# EasyEDA Pro project Ada - V2 as built.eprj

# Schematic Main Board

## Sheets
1 Daughter Cards: Board Name: Board1; Create Date: 2024-08-08; Page Name: Daughter Cards; Project Name: Ada; Schematic Name: Main Board; Update Date: 2024-10-03
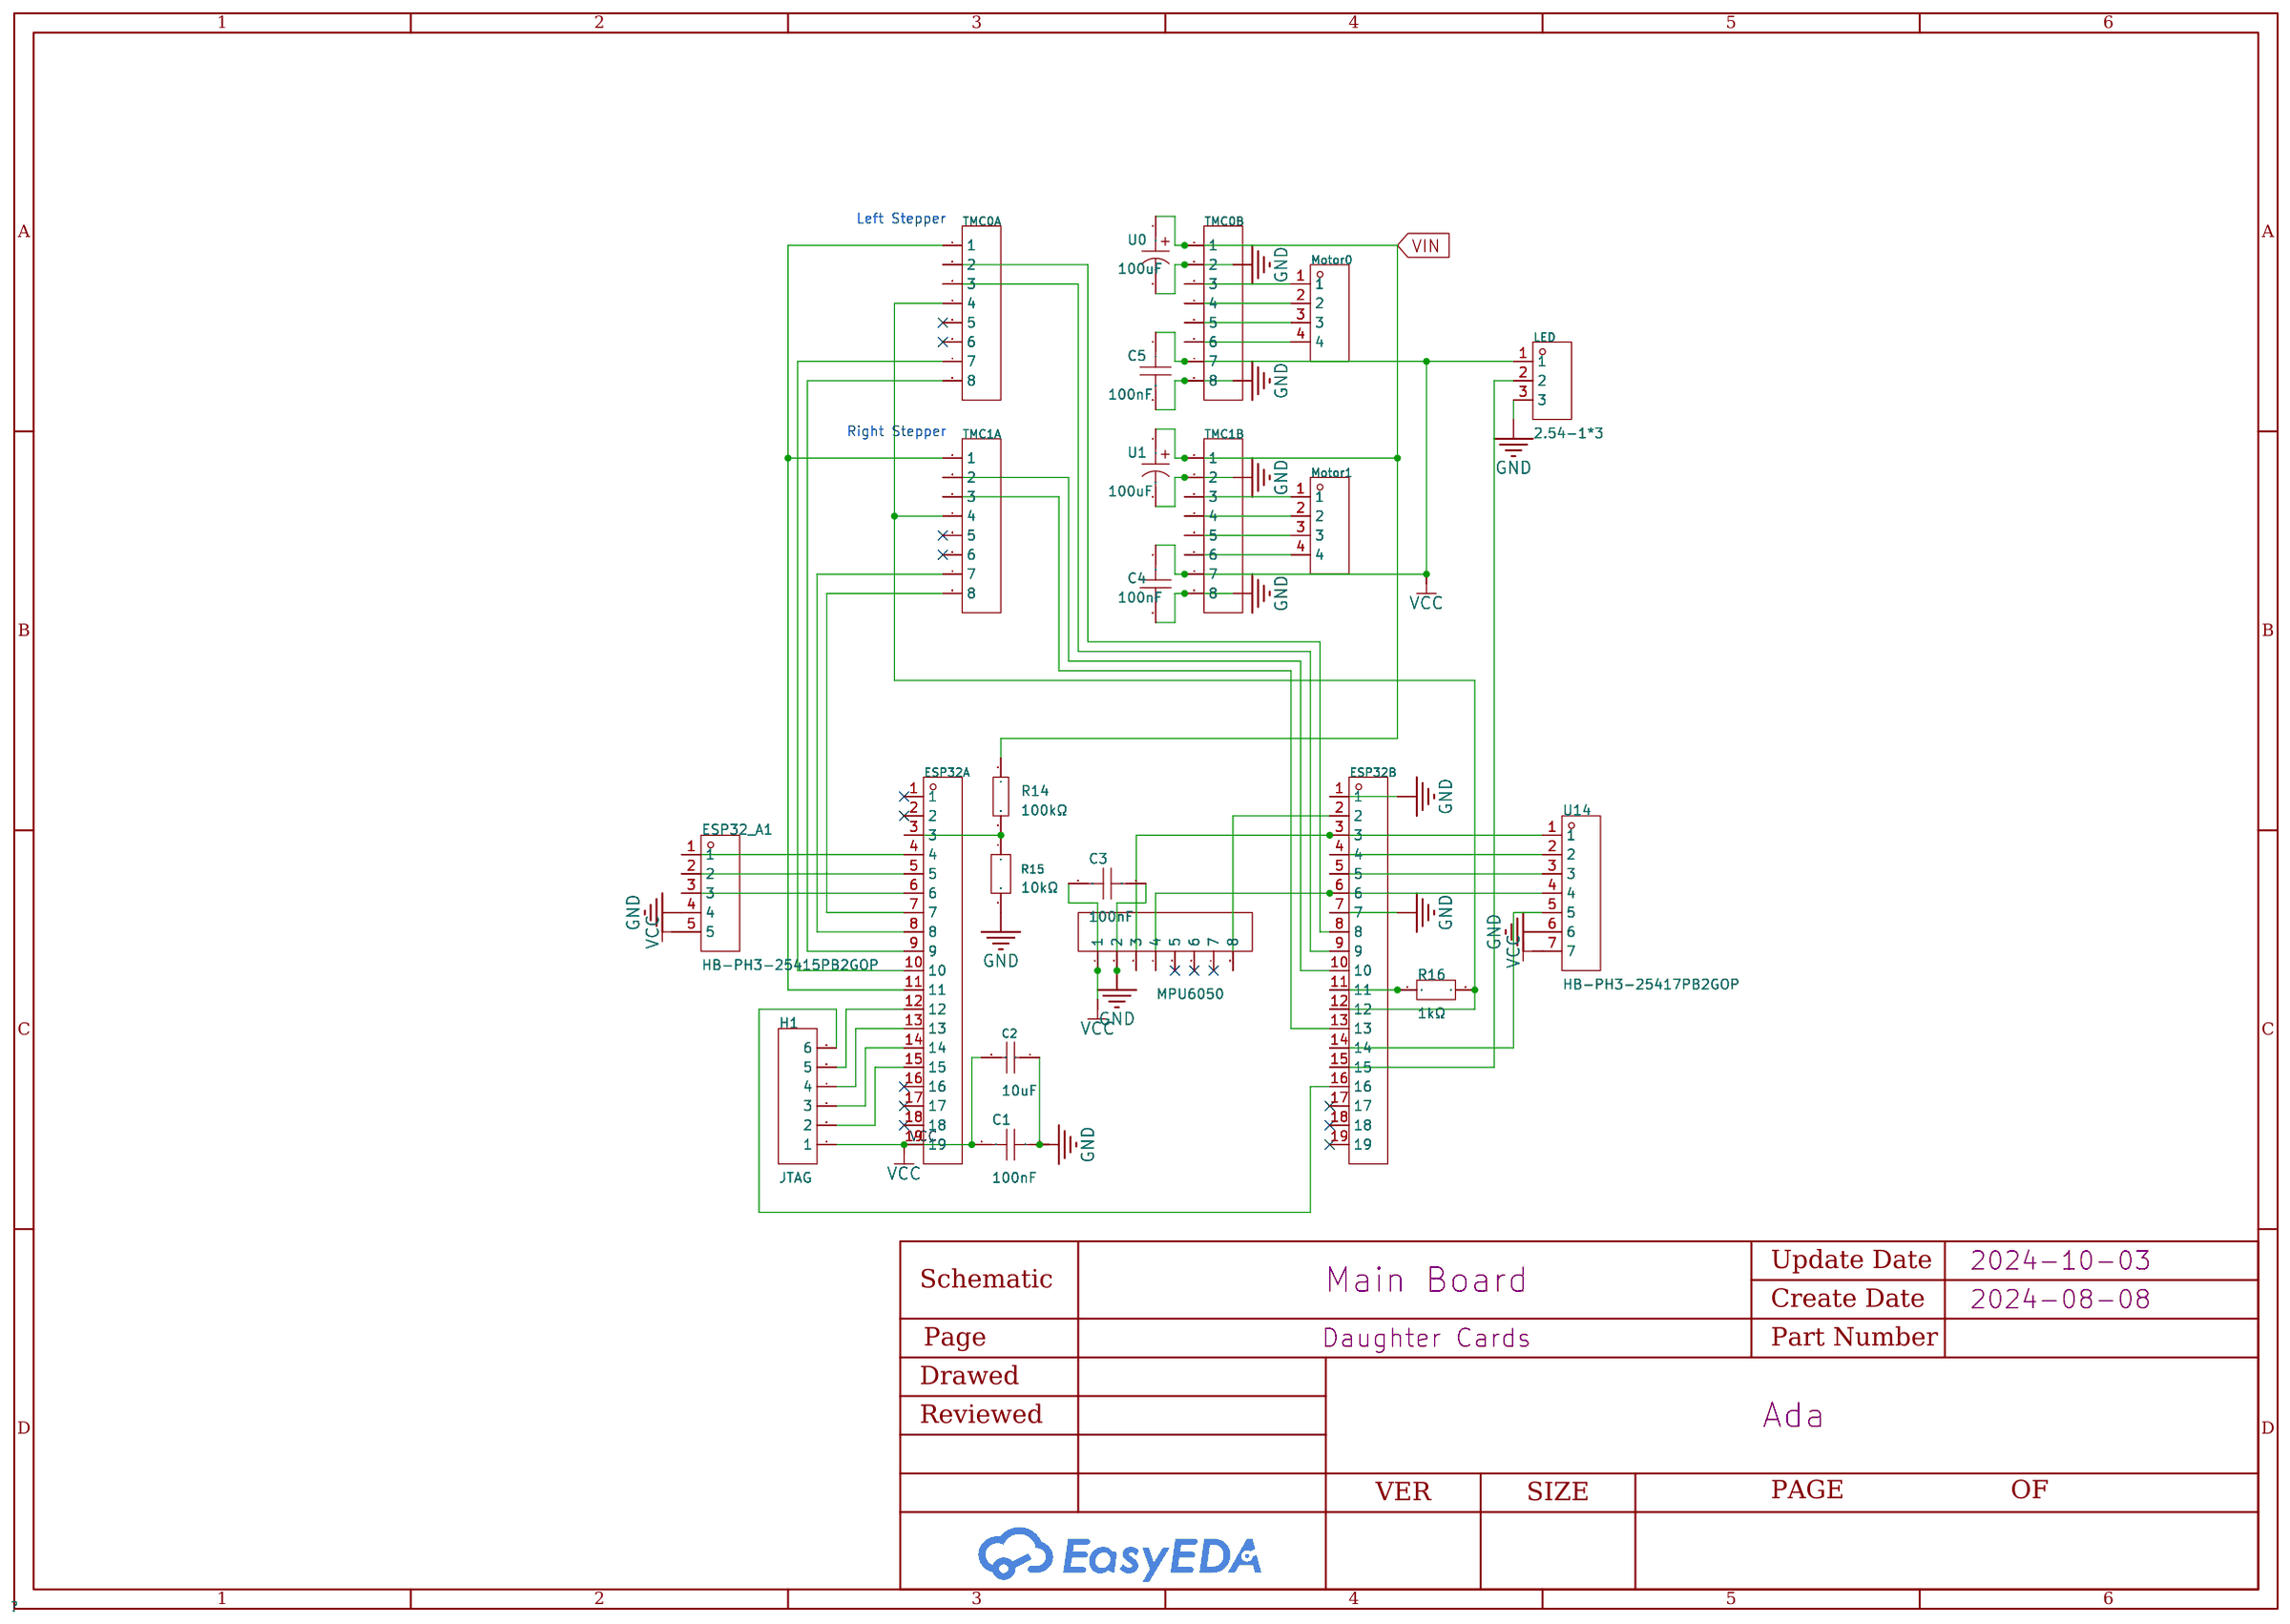
[diagram p0: Daughter Cards]
2 Power Circuit: Page Name: Power Circuit
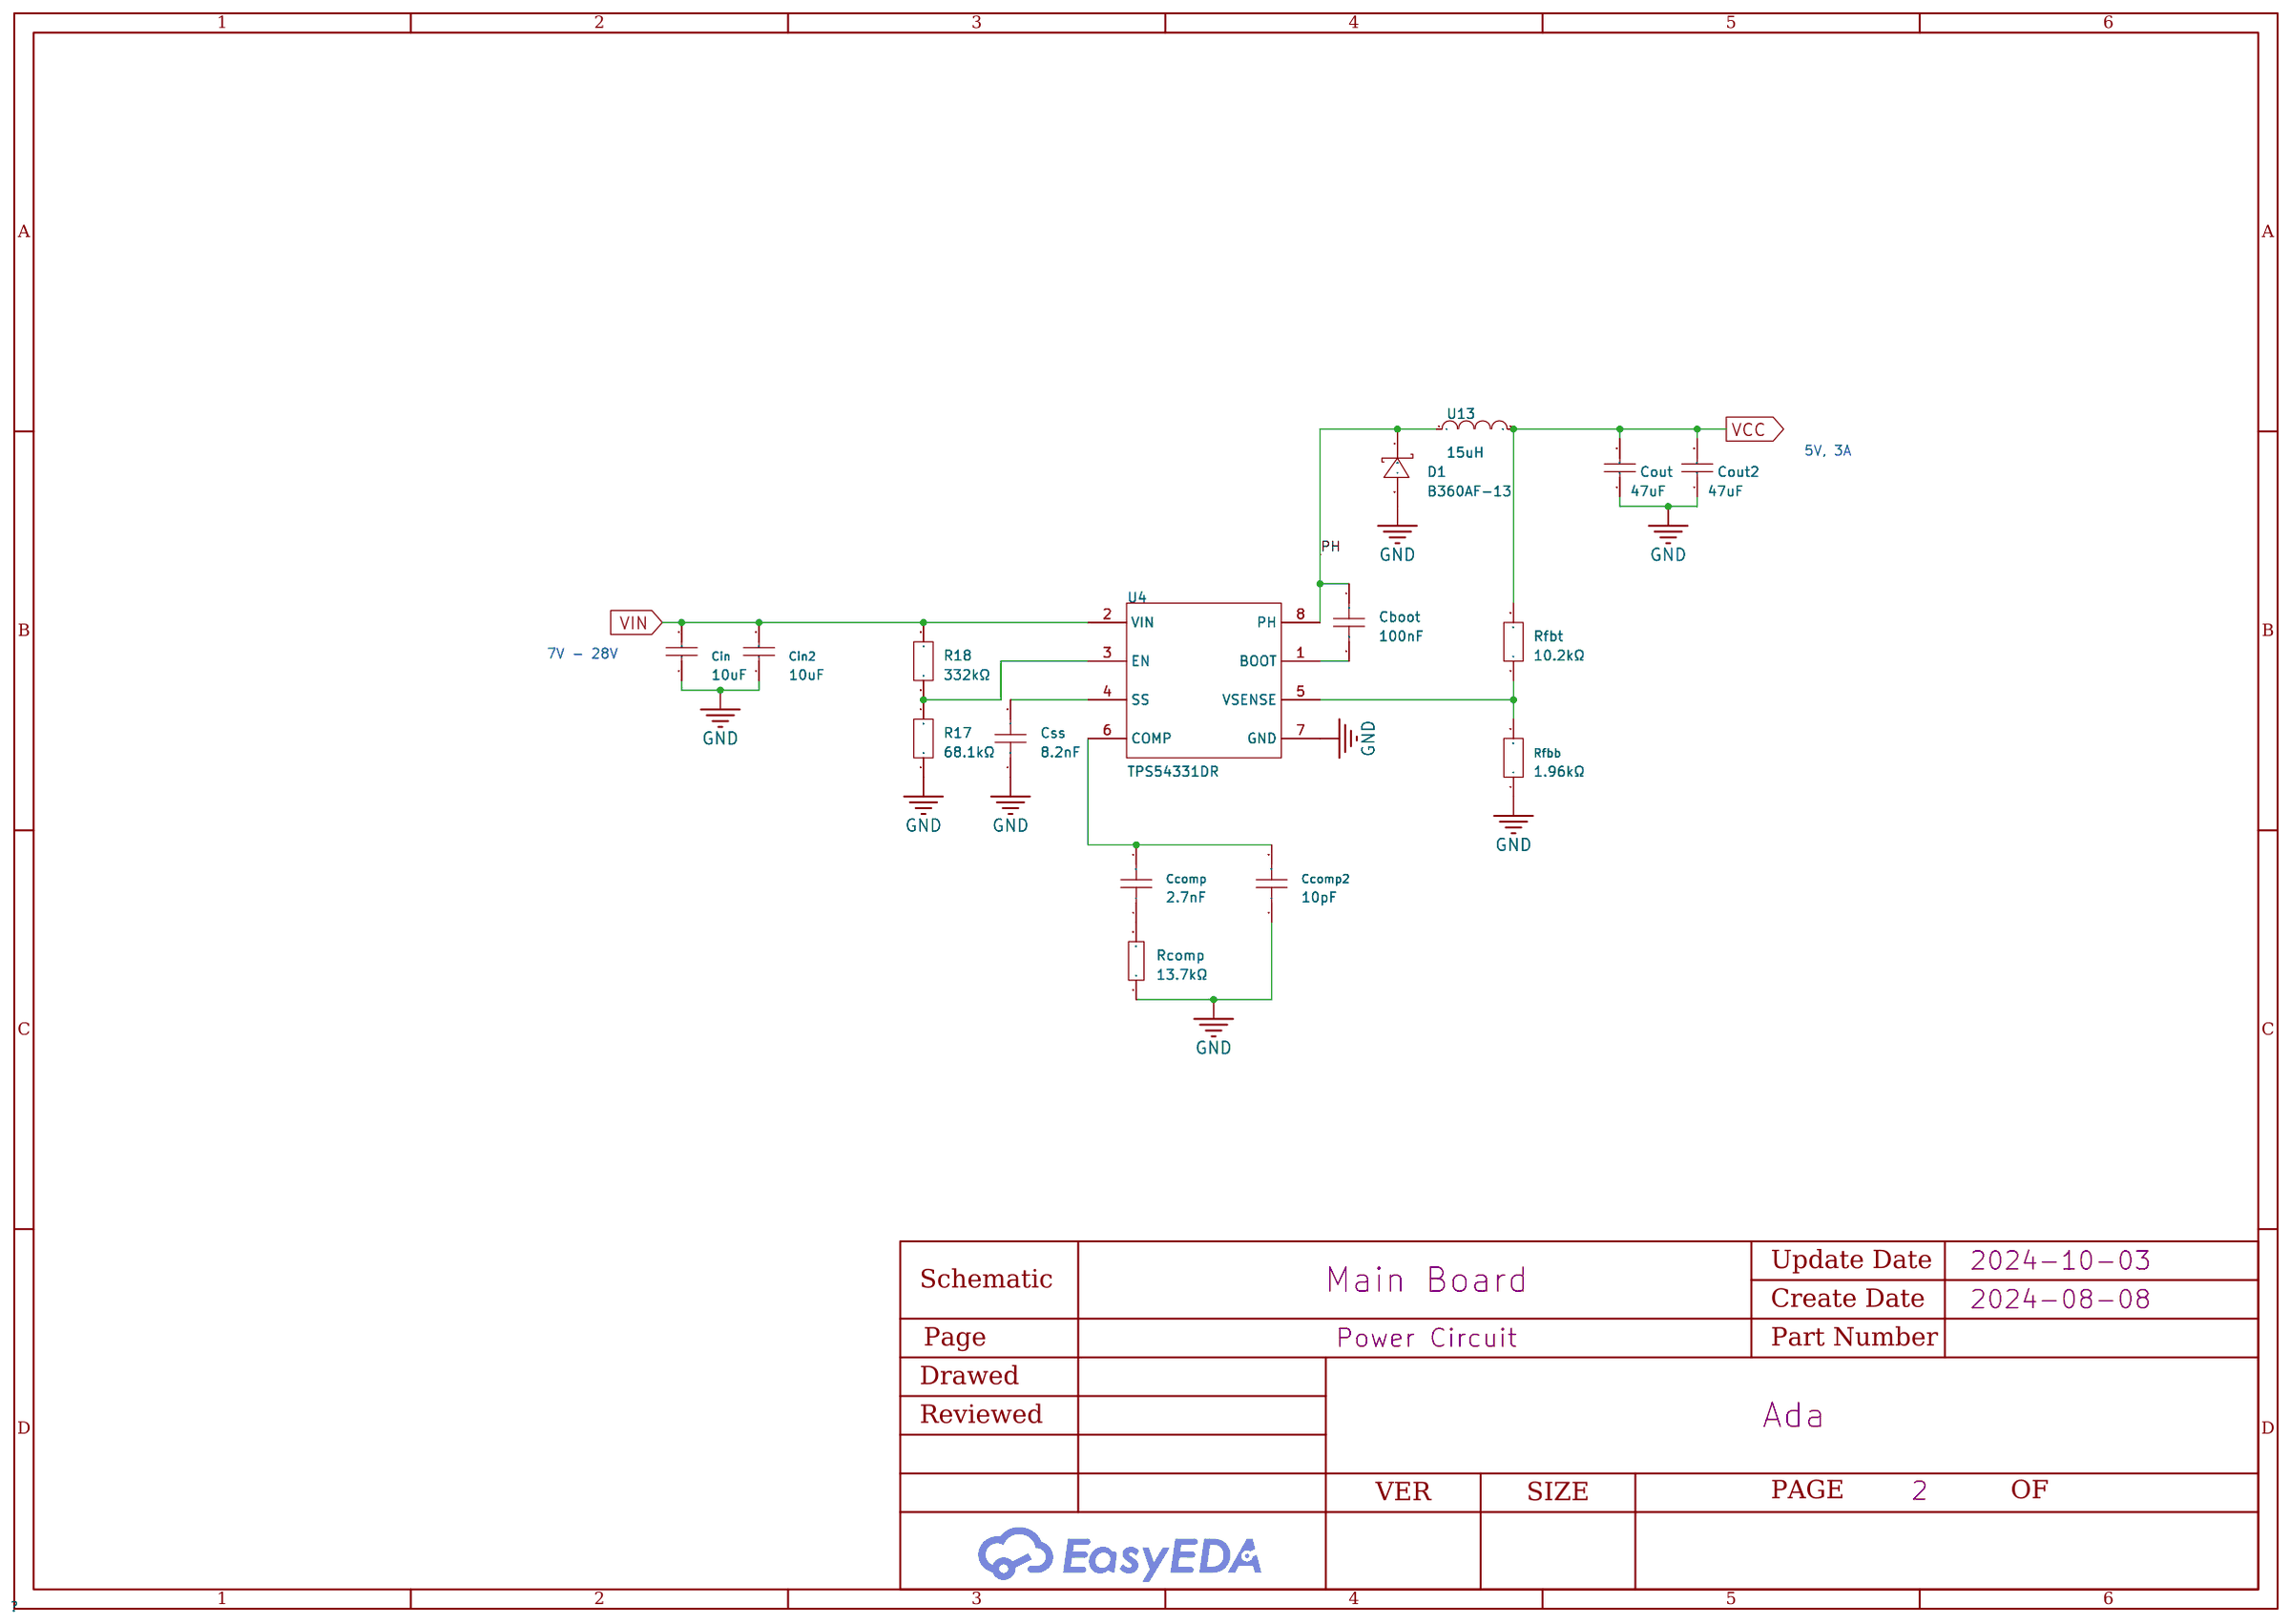
[diagram p1: Power Circuit]

## Parts
sheet Daughter Cards
C1  100nF  [C0201]
C2  10uF  [C0402]
C3  100nF  [C0201]
C4  100nF  [C0201]
C5  100nF  [C0201]
ESP32_A1  HB-PH3-25415PB2GOP  [HDR-TH_5P-P2.54-V-M]
ESP32A  ESP32  [HDR-TH_19P-P2.54-V-F]
ESP32B  2.54-1*19P母  [HDR-TH_19P-P2.54-V-F]
H1  JTAG  [HDR-TH_6P-P2.54-V-M-1]
LED  2.54-1*3  [HDR-TH_3P-P2.54-V-M-1]
Motor0  Motor 0  [HDR-TH_4P-P2.54-V-M]
Motor1  Motor 1  [HDR-TH_4P-P2.54-V-M]
MPU6050  MPU6050  [HDR-TH_8P-P2.54-V-F-1]
R14  100kΩ  [R0201]
R15  10kΩ  [R0201]
R16  1kΩ  [R01005]
TMC0A  TMC0A  [HDR-TH_8P-P2.54-V-F-1]
TMC0B  2.54-1*8P母环保  [HDR-TH_8P-P2.54-V-F-1]
TMC1A  TMC2209  [HDR-TH_8P-P2.54-V-F-1]
TMC1B  2.54-1*8P母环保  [HDR-TH_8P-P2.54-V-F-1]
U0  100uF  [CAP-TH_BD6.3-P2.50-D0.5-FD]
U1  100uF  [CAP-TH_BD6.3-P2.50-D0.5-FD]
U14  HB-PH3-25417PB2GOP  [HDR-TH_7P-P2.54-V-M]
sheet Power Circuit
Cboot  100nF  [C0201]
Ccomp  2.7nF  [C0402]
Ccomp2  10pF  [C0402]
Cin  10uF  [C1206]
Cin2  10uF  [C1206]
Cout  47uF  [C0805]
Cout2  47uF  [C0805]
Css  8.2nF  [C0201]
D1  B360AF-13  [SMA_L4.4-W2.6-LS5.0-RD]
R17  68.1kΩ  [R0201]
R18  332kΩ  [R0201]
Rcomp  13.7kΩ  [R0201]
Rfbb  1.96kΩ  [R0201]
Rfbt  10.2kΩ  [R0201]
U4  TPS54331DR  [SOIC-8_L5.0-W4.0-P1.27-LS6.0-BL]
U13  15uH  [IND-SMD_L7.2-W6.6_GPSR07X0]

## Library data of the parts
C1 C3-C5 Cboot = CL03A104KQ3NNNC: Capacitance: Tolerance:±10% Tolerance:±10% Voltage Rated: Temperature Coefficient:; LCSC Part Name: 100nF ±10% 6.3V; Supplier Part: C160831; Manufacturer: SAMSUNG(三星); Supplier Footprint: 0201; Datasheet: https://atta.szlcsc.com/upload/public/pdf/source/20171228/C163510_15144412327381213809.pdf; Supplier: LCSC; Tolerance: ±10%
C2 = CL05A106MQ5NUNC: Capacitance: Tolerance:±20% Tolerance:±20% Voltage Rated: Temperature Coefficient:; LCSC Part Name: 10uF ±20% 6.3V; Supplier Part: C15525; Manufacturer: SAMSUNG(三星); Supplier Footprint: 0402; Datasheet: https://atta.szlcsc.com/upload/public/pdf/source/20220823/2B02EE04F8F211D38A52DCB16EB6BEBA.pdf; Supplier: LCSC; Tolerance: ±20%
ESP32_A1 = HB-PH3-25415PB2GOP: LCSC Part Name: 间距:2.54mm 1x5P 直插 方针; Supplier Part: C6332198; Manufacturer: HANBO(汉博); Supplier Footprint: 插件,P=2.54mm; Datasheet: https://atta.szlcsc.com/upload/public/pdf/source/20230803/F72D259687963761DF1B552F3BB84A31.pdf; Supplier: LCSC; Pin Structure: 1x5P; Pitch: 2.54mm; Row Spacing: 2.54mm; Circluar Pins/Square Pins: Square Pins; Mounting Type: Straight; Number of Rows: Plugin; Number of Pins: 5P; Current Rating (Max): 3A; Voltage Rating (Max): 250V; Length of Mating Pin: 6mm; Insulation Height: 2.54mm; Length of End Connection Pin: 3mm; Contact Plating: Gold; Operating Temperature Range: -40℃~+105℃; Soldering Temperature(Max): 260℃; Color: Black
ESP32A ESP32B = 2.54-1*19P母: Pitch:2.54mm Row Spacing:- Mounting Type:Straight Number of Rows:Plugin Number of Holes:19P Insulation Height:- Contact Material:- Contact Plating:-; LCSC Part Name: 间距:2.54mm 直插; Supplier Part: C319202; Manufacturer: BOOMELE(博穆精密); Supplier Footprint: 插件,P=2.54mm; JLCPCB Part Class: Extended Part; Supplier: LCSC; Pitch: 2.54mm; Mounting Type: Straight; Number of Rows: Plugin; Number of Holes: 19P
H1 = 2.54-1x6P直针: Pin Structure:1x6P Pitch:2.54mm Row Spacing:- Circluar Pins/Square Pins:Square Pins Mounting Type:Straight Number of Rows:Plugin Number of Pins:6P Current Rating (Max):3A Voltage Rating (Max):- Length of Mating Pin:- Insulation Height:- Contact Material:; LCSC Part Name: 间距:2.54mm 1x6P 直插 方针; Supplier Part: C37208; Manufacturer: BOOMELE(博穆精密); Supplier Footprint: 插件,P=2.54mm; JLCPCB Part Class: Extended Part; Supplier: LCSC; Pin Structure: 1x6P; Pitch: 2.54mm; Circluar Pins/Square Pins: Square Pins; Mounting Type: Straight; Number of Rows: Plugin; Number of Pins: 6P; Current Rating (Max): 3A; Operating Temperature Range: -40℃~+105℃; Color: Black
LED = 2.54-1*3: Pin Structure:1x3P Pitch:2.54mm Number of Rows:Plugin Number of Pins:3P Contact Plating:Gold; LCSC Part Name: 停产; Supplier Part: C5116482; Manufacturer: ZHOURI(洲日); Supplier Footprint: 插件,P=2.54mm; Datasheet: https://atta.szlcsc.com/upload/public/pdf/source/20220729/4DB71EF9013296CFACD97372BAB8A1F0.pdf; Supplier: LCSC; Pin Structure: 1x3P; Pitch: 2.54mm; Number of Rows: Plugin; Number of Pins: 3P; Contact Plating: Gold
Motor0 Motor1 = PZ254V-11-04P: Pin Structure:1x4P Pitch:2.54mm Row Spacing:- Circluar Pins/Square Pins:Square Pins Mounting Type:Straight Number of Rows:Plugin Number of Pins:4P Current Rating (Max):3A Voltage Rating (Max):250V Length of Mating Pin:6mm Insulation Height:2.5mm Length of; LCSC Part Name: 间距:2.54mm 1x4P 直插 方针; Supplier Part: C2691448; Manufacturer: XFCN(兴飞); Supplier Footprint: 插件,P=2.54mm; JLCPCB Part Class: Extended Part; Datasheet: https://atta.szlcsc.com/upload/public/pdf/source/20200309/C492403_F9F19131791D08044AD4F84F8E751A34.pdf; Supplier: LCSC; Pin Structure: 1x4P; Pitch: 2.54mm; Circluar Pins/Square Pins: Square Pins; Mounting Type: Straight; Number of Rows: Plugin; Number of Pins: 4P; Current Rating (Max): 3A; Voltage Rating (Max): 250V; Length of Mating Pin: 6mm; Insulation Height: 2.5mm; Length of End Connection Pin: 3mm; Operating Temperature Range: -40℃~+105℃; Color: Black
MPU6050 TMC0A TMC0B TMC1A TMC1B = 2.54-1*8P母环保: Holes Structure:1x8P Pitch:2.54mm Row Spacing:- Mounting Type:Straight Number of Rows:Plugin Number of Holes:8P Insulation Height:- Contact Material:- Contact Plating:-; LCSC Part Name: 间距:2.54mm 1x8P 直插; Supplier Part: C27438; Manufacturer: BOOMELE(博穆精密); Supplier Footprint: 插件,P=2.54mm; JLCPCB Part Class: Extended Part; Datasheet: https://atta.szlcsc.com/upload/public/pdf/source/20231221/1CA800C6799ED97958773716FAA1BFFE.pdf; Supplier: LCSC; Holes Structure: 1x8P; Pitch: 2.54mm; Mounting Type: Straight; Number of Rows: Plugin; Number of Holes: 8P
R14 = 0201WMF1003TEE: Type:Thick Film Resistors Resistance:100kΩ Tolerance:±1% Tolerance:±1% Power(Watts): Overload Voltage (Max): Temperature Coefficient:±200ppm/℃ Temperature Coefficient:±200ppm/℃ Operating Temperature Range:-55℃~+155℃ Operating Temperature Range:-55℃~+155℃; LCSC Part Name: 100kΩ ±1% 50mW 厚膜电阻; Supplier Part: C270364; Manufacturer: UNI-ROYAL(厚声); Supplier Footprint: 0201; Datasheet: https://atta.szlcsc.com/upload/public/pdf/source/20200306/C422600_1E6D84923E4A46A82E41ADD87F860B5C.pdf; Supplier: LCSC; Type: Thick Film Resistors; Tolerance: ±1%; Temperature Coefficient: ±200ppm/℃; Operating Temperature Range: -55℃~+155℃
R15 = 0201WMF1002TEE: Type:Thick Film Resistors Resistance:10kΩ Tolerance:±1% Tolerance:±1% Power(Watts): Overload Voltage (Max): Temperature Coefficient:±200ppm/℃ Temperature Coefficient:±200ppm/℃ Operating Temperature Range:-55℃~+155℃ Operating Temperature Range:-55℃~+155℃; LCSC Part Name: 10kΩ ±1% 50mW 厚膜电阻; Supplier Part: C473048; Manufacturer: UNI-ROYAL(厚声); Supplier Footprint: 0201; Datasheet: https://atta.szlcsc.com/upload/public/pdf/source/20200306/C422600_1E6D84923E4A46A82E41ADD87F860B5C.pdf; Supplier: LCSC; Type: Thick Film Resistors; Tolerance: ±1%; Temperature Coefficient: ±200ppm/℃; Operating Temperature Range: -55℃~+155℃
R16 = 0105WHJ0102TDE: LCSC Part Name: 厚膜电阻 1kΩ 31.25mW ±5%; Supplier Part: C407788; Manufacturer: UNI-ROYAL(厚声); Supplier Footprint: 01005; Datasheet: https://atta.szlcsc.com/upload/public/pdf/source/20200306/C422600_1E6D84923E4A46A82E41ADD87F860B5C.pdf; Supplier: LCSC; Type: Thick Film Resistors; Tolerance: ±5%; Operating Temperature Range: -55℃~+125℃
U0 U1 = 03EC0728: Capacitance: Tolerance:±20% Tolerance:±20% Rated Voltage: Ripple Current:140mA@120kHz Equivalent Series Resistance(ESR):- Lead Spacing: φD: L: Lifetime @ Temp:2000hrs@105℃ Operating Temperature:-40℃~+105℃ Operating Temperature:-40℃~+105℃; LCSC Part Name: 100uF ±20% 25V; Supplier Part: C2831782; Manufacturer: KNSCHA(科尼盛); Supplier Footprint: 插件,D6.3xL12mm; Datasheet: https://atta.szlcsc.com/upload/public/pdf/source/20210511/C2831782_5BCB0B9CD26517435D205DF95E3C4F67.pdf; Supplier: LCSC; Tolerance: ±20%; Ripple Current: 140mA@120kHz; Lifetime @ Temp: 2000hrs@105℃; Operating Temperature: -40℃~+105℃
U14 = HB-PH3-25417PB2GOP: LCSC Part Name: 间距:2.54mm 1x7P 直插 方针; Supplier Part: C6332200; Manufacturer: HANBO(汉博); Supplier Footprint: 插件,P=2.54mm; Datasheet: https://atta.szlcsc.com/upload/public/pdf/source/20230803/F72D259687963761DF1B552F3BB84A31.pdf; Supplier: LCSC; Pin Structure: 1x7P; Pitch: 2.54mm; Row Spacing: 2.54mm; Circluar Pins/Square Pins: Square Pins; Mounting Type: Straight; Number of Rows: Plugin; Number of Pins: 7P; Current Rating (Max): 3A; Voltage Rating (Max): 250V; Length of Mating Pin: 6mm; Insulation Height: 2.54mm; Length of End Connection Pin: 3mm; Contact Plating: Gold; Operating Temperature Range: -40℃~+105℃; Soldering Temperature(Max): 260℃; Color: Black
Ccomp = CC0402KRX7R8BB272: LCSC Part Name: 2.7nF ±10% 25V; Supplier Part: C541392; Manufacturer: YAGEO(国巨); Supplier Footprint: 0402; JLCPCB Part Class: Extended Part; Datasheet: https://atta.szlcsc.com/upload/public/pdf/source/20200615/C541392_495A23F5A074B409E8C2725CF86F8525.pdf; Supplier: LCSC; Tolerance: ±10%
Ccomp2 = 0402N100J250CT: LCSC Part Name: 10pF ±5% 25V; Supplier Part: C424825; Manufacturer: Walsin(华新科); Supplier Footprint: 0402; JLCPCB Part Class: Extended Part; Datasheet: https://atta.szlcsc.com/upload/public/pdf/source/20191217/C469650_84AD5C6F618CF4AC0C6D987F2E8FE6F8.pdf; Supplier: LCSC; Tolerance: ±5%
Cin Cin2 = CL31A106KAHNNNE: LCSC Part Name: 10uF ±10% 25V; Supplier Part: C9807; Manufacturer: SAMSUNG(三星); Supplier Footprint: 1206; JLCPCB Part Class: Extended Part; Datasheet: https://atta.szlcsc.com/upload/public/pdf/source/20160218/1457707763339.pdf; Supplier: LCSC; Tolerance: ±10%
Cout Cout2 = CL21A476MQYNNNE: Capacitance: Tolerance:±20% Tolerance:±20% Voltage Rated: Temperature Coefficient:; LCSC Part Name: 47uF ±20% 6.3V; Supplier Part: C16780; Manufacturer: SAMSUNG(三星); Supplier Footprint: 0805; Datasheet: https://atta.szlcsc.com/upload/public/pdf/source/20160218/1457707763339.pdf; Supplier: LCSC; Tolerance: ±20%
Css = C0603X7R822KDTS: LCSC Part Name: 8.2nF ±10% 10V; Supplier Part: C311849; Manufacturer: DARFON(达方); Supplier Footprint: 0201; Datasheet: https://atta.szlcsc.com/upload/public/pdf/source/20190902/C424339_65E80B11205B7B8B44D3E281FEB76198.pdf; Supplier: LCSC; Tolerance: ±10%
D1 = B360AF-13: LCSC Part Name: 电压:60V 电流:3A; Supplier Part: C3759255; Manufacturer: DIODES(美台); Supplier Footprint: DO-214AD; Datasheet: https://atta.szlcsc.com/upload/public/pdf/source/20230810/BF6A118B9AE348B2EB87E7E4B479560B.pdf; Supplier: LCSC; Forward Voltage (Vf@If): 650mV@3A; Reverse Voltage (Vr): 60V; Average Rectified Current (Io): 3A; Reverse Leakage Current (Ir): 200uA@60V
R17 = RM02FTN6812: Type:Thick Film Resistors Resistance: Tolerance:±1% Tolerance:±1% Power(Watts): Overload Voltage (Max): Temperature Coefficient:±200ppm/℃ Temperature Coefficient:±200ppm/℃ Operating Temperature Range:-55℃~+125℃ Operating Temperature Range:-55℃~+125℃; LCSC Part Name: 厚膜电阻 68.1kΩ ±1% 50mW; Supplier Part: C240092; Manufacturer: 大毅科技; Supplier Footprint: 0201; Datasheet: https://atta.szlcsc.com/upload/public/pdf/source/20200305/C491353_4BC01484F675BA310BC57D69F4960000.pdf; Supplier: LCSC; Type: Thick Film Resistors; Tolerance: ±1%; Temperature Coefficient: ±200ppm/℃; Operating Temperature Range: -55℃~+125℃
R18 = 0201WMF3323TEE: LCSC Part Name: 332kΩ ±1% 50mW 厚膜电阻; Supplier Part: C423578; Manufacturer: UNI-ROYAL(厚声); Supplier Footprint: 0201; Datasheet: https://atta.szlcsc.com/upload/public/pdf/source/20200306/C422600_1E6D84923E4A46A82E41ADD87F860B5C.pdf; Supplier: LCSC; Type: Thick Film Resistors; Tolerance: ±1%; Temperature Coefficient: ±200ppm/℃; Operating Temperature Range: -55℃~+155℃
Rcomp = RC-01W1372FT: LCSC Part Name: 厚膜电阻 13.7kΩ ±1% 50mW; Supplier Part: C320695; Manufacturer: FH(风华); Supplier Footprint: 0201; JLCPCB Part Class: Extended Part; Datasheet: https://atta.szlcsc.com/upload/public/pdf/source/20140616/1457707091974.pdf; Supplier: LCSC; Type: Thick Film Resistors; Tolerance: ±1%; Temperature Coefficient: ±200ppm/℃; Operating Temperature Range: -55℃~+125℃
Rfbb = 0201WMF1961TEE: LCSC Part Name: 1.96kΩ ±1% 50mW 厚膜电阻; Supplier Part: C423676; Manufacturer: UNI-ROYAL(厚声); Supplier Footprint: 0201; Datasheet: https://atta.szlcsc.com/upload/public/pdf/source/20200306/C422600_1E6D84923E4A46A82E41ADD87F860B5C.pdf; Supplier: LCSC; Type: Thick Film Resistors; Tolerance: ±1%; Temperature Coefficient: ±200ppm/℃; Operating Temperature Range: -55℃~+155℃
Rfbt = RTT011022FTH: Type:Thick Film Resistors Resistance: Tolerance:±1% Tolerance:±1% Power(Watts): Overload Voltage (Max): Temperature Coefficient:±200ppm/℃ Temperature Coefficient:±200ppm/℃ Operating Temperature Range:-55℃~+125℃ Operating Temperature Range:-55℃~+125℃; LCSC Part Name: 厚膜电阻 10.2kΩ ±1% 50mW; Supplier Part: C166388; Manufacturer: RALEC(旺诠); Supplier Footprint: 0201; Datasheet: https://atta.szlcsc.com/upload/public/pdf/source/20180928/C303758_52AE496EA05AD4D633595C32F5A0EBAF.pdf; Supplier: LCSC; Type: Thick Film Resistors; Tolerance: ±1%; Temperature Coefficient: ±200ppm/℃; Operating Temperature Range: -55℃~+125℃
U4 = TPS54331DR: Function:Step-down type Output Type:Adjustable Input Voltage:3.5V~28V Input Voltage:3.5V~28V Output Voltage:800mV~25V Output Voltage:800mV~25V Output Current (Max):3A Switching Frequency:570kHz Operating Temperature:-40℃~+150℃@(TJ) Operating Temperature:-; Supplier Part: C9865; Manufacturer: TI(德州仪器); Supplier Footprint: SOIC-8; Datasheet: https://www.ti.com/cn/lit/gpn/tps54331; Supplier: LCSC; Function: Step-down type; Output Type: Adjustable; Input Voltage: 3.5V~28V; Output Voltage: 800mV~25V; Output Current (Max): 3A; Switching Frequency: 570kHz; Operating Temperature: -40℃~+150℃@(TJ); Synchronous Rectification: NO; Number of Outputs: 1; Topology: Step-down; Switch tube (built-in/external): 内置
U13 = CYA0630-15UH: LCSC Part Name: 15uH ±20%; Supplier Part: C5189959; Manufacturer: SHOU HAN(首韩); Supplier Footprint: SMD,7.2x6.6mm; Datasheet: https://atta.szlcsc.com/upload/public/pdf/source/20230523/5F86F4489D0E29735640AB8FD07036BA.pdf; Supplier: LCSC; Tolerance: ±20%; DC Resistance (DCR): 98mΩ

## Nets
GND: C1.2 C2.1 C3.2 C4.2 C5.2 Ccomp2.1 Cin.1 Cin2.1 Cout.1 Cout2.1 Css.1 D1.2(A) ESP32_A1.4 ESP32B.1 ESP32B.7 LED.3 MPU6050.2 R15.2 R17.1 Rcomp.1 Rfbb.1 TMC0B.2 TMC0B.8 TMC1B.2 TMC1B.8 U0.2 U1.2 U4.7(GND) U14.6
VCC: C1.1 C2.2 C3.1 C4.1 C5.1 Cout.2 Cout2.2 ESP32_A1.5 ESP32A.19 H1.1 LED.1 MPU6050.1 Rfbt.2 TMC0B.7 TMC1B.7 U13.2 U14.7
VIN: Cin.2 Cin2.2 R14.1 R18.2 TMC0B.1 TMC1B.1 U0.1 U1.1 U4.2(VIN)
PH: Cboot.1 D1.1(C) U4.8(PH) U13.1
$1N2154: Motor1.1 TMC1B.3
$1N2157: Motor1.2 TMC1B.4
$1N2160: Motor1.3 TMC1B.5
$1N2163: Motor1.4 TMC1B.6
$1N2166: Motor0.1 TMC0B.3
$1N2169: Motor0.2 TMC0B.4
$1N2172: Motor0.3 TMC0B.5
$1N2175: Motor0.4 TMC0B.6
$1N2313: ESP32A.8 TMC1A.7
$1N2318: ESP32A.9 TMC0A.8
$1N2522: ESP32B.11 R16.1
$1N11068: ESP32A.13 H1.4
$1N11073: ESP32A.14 H1.3
$1N11078: ESP32A.15 H1.2
$1N15484: ESP32A.12 H1.5
$1N15612: ESP32B.16 H1.6
$1N19994: ESP32B.15 LED.2
$1N28037: ESP32A.3 R14.2 R15.1
$1N28083: ESP32A.10 TMC0A.7
$1N28088: ESP32A.7 TMC1A.8
$1N28304: ESP32A.11 TMC0A.1 TMC1A.1
$1N28357: ESP32B.8 TMC0A.2
$1N28418: ESP32B.9 TMC0A.3
$1N28428: ESP32B.12 R16.2 TMC0A.4 TMC1A.4
$1N28444: ESP32B.10 TMC1A.2
$1N28452: ESP32B.13 TMC1A.3
$1N31798: ESP32_A1.1 ESP32A.4
$1N31802: ESP32_A1.2 ESP32A.5
$1N31807: ESP32_A1.3 ESP32A.6
$1N31812: ESP32B.14 U14.5
$1N31817: ESP32B.5 U14.3
$1N31823: ESP32B.4 U14.2
$2N758: Css.2 U4.4(SS)
$2N763: Cboot.2 U4.1(BOOT)
$2N769: R17.2 R18.1 U4.3(EN)
$2N774: Ccomp.2 Ccomp2.2 U4.6(COMP)
$2N777: Rfbb.2 Rfbt.1 U4.5(VSENSE)
$2N4046: Ccomp.1 Rcomp.2
Net-(ESP32B-2): ESP32B.2 MPU6050.8
Net-(ESP32B-3): ESP32B.3 MPU6050.3 U14.1
Net-(ESP32B-6): ESP32B.6 MPU6050.4 U14.4

Not connected (* = marked no-connect by the designer): ESP32A 1* 2* 16* 17* 18*; ESP32B 17* 18* 19*; MPU6050 5* 6* 7*; TMC0A 5* 6*; TMC1A 5* 6*

## Notes on the sheets
sheet 1
- Left Stepper
- Right Stepper
sheet 2
- 5V, 3A
- 7V - 28V

# Board PCB1
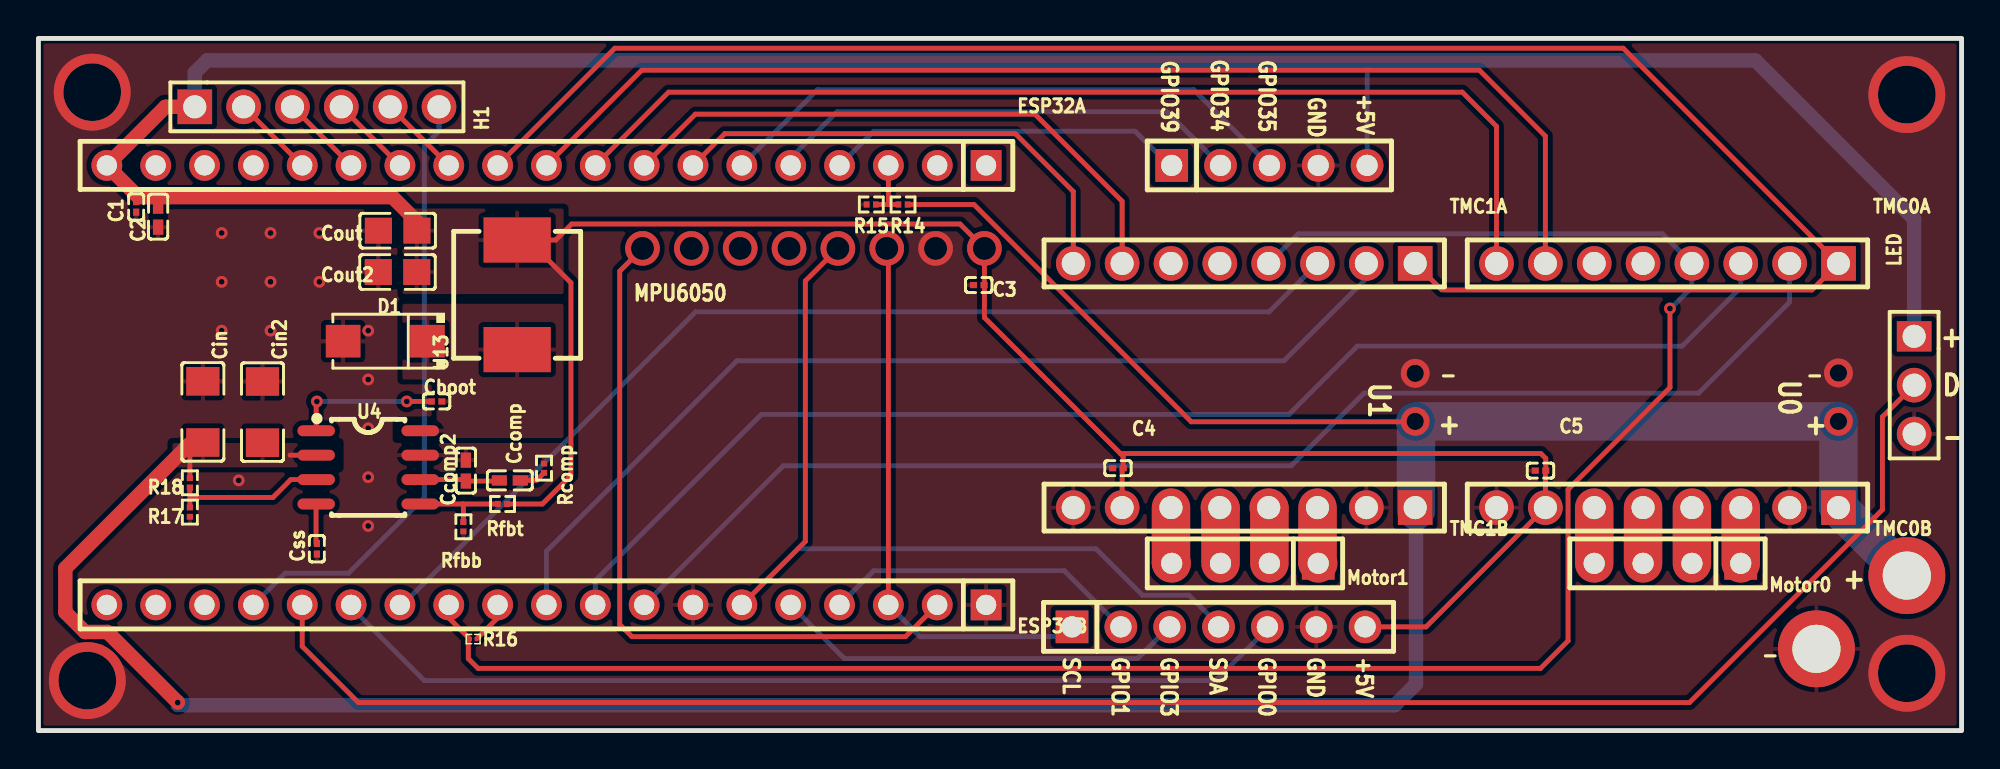
[diagram p2: board, top side]
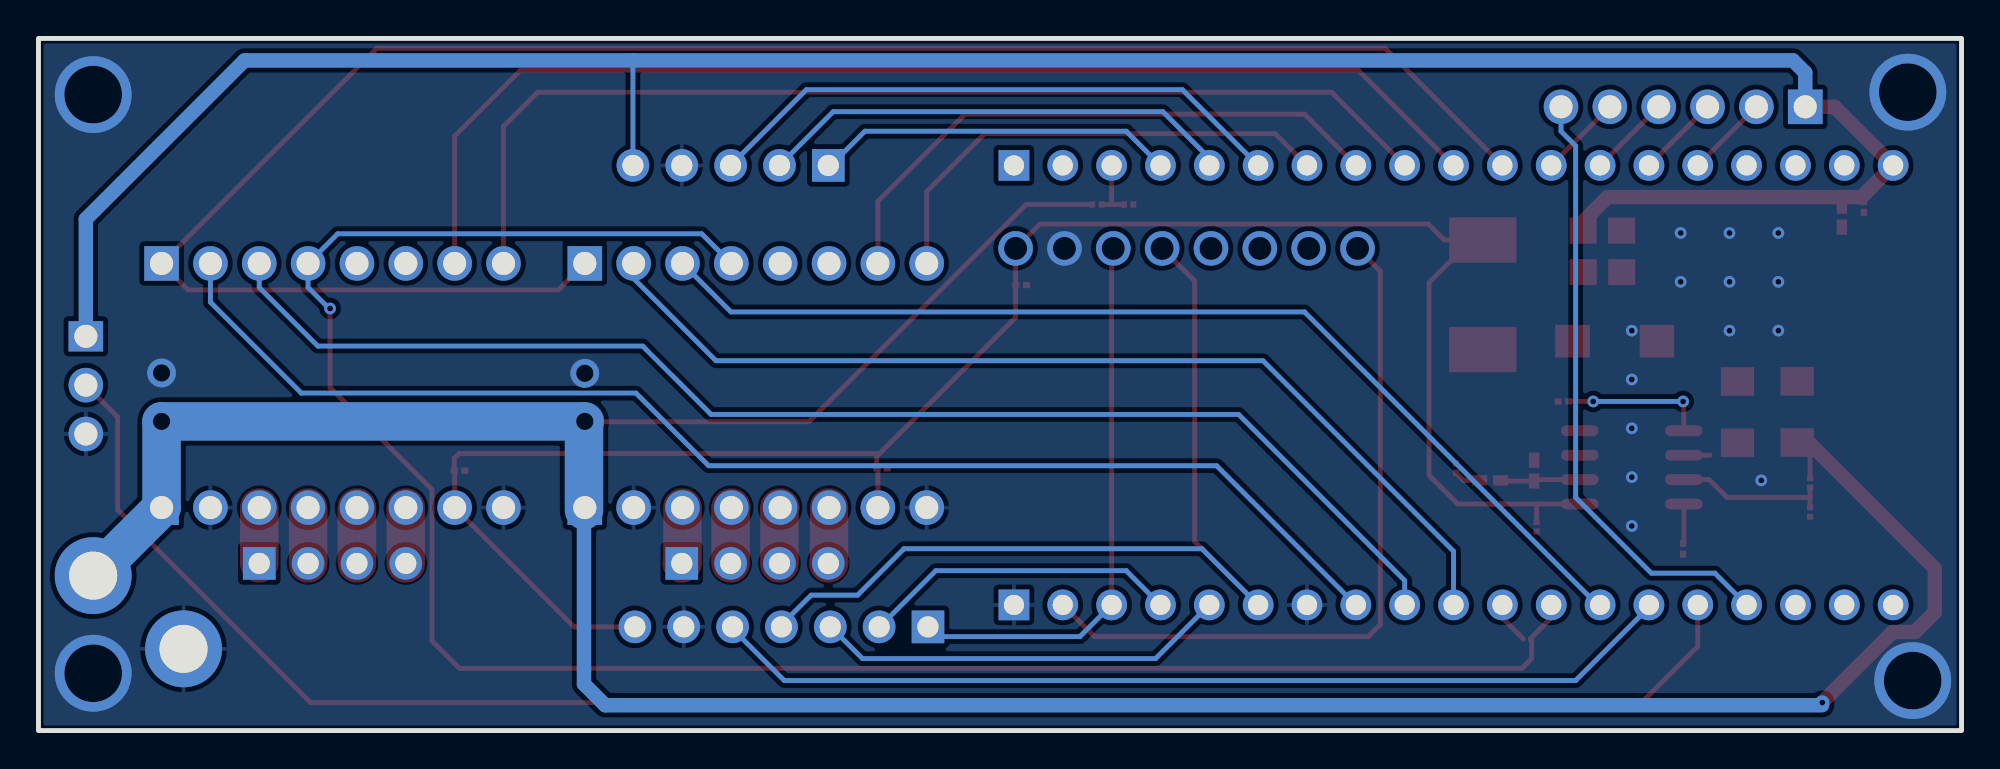
[diagram p3: board, bottom side, seen from below]

Outline 100 x 36 mm; copper layers: Top Layer, Bottom Layer. Coordinates in mm from the lower left corner of the outline.
Outline path: rectangle 0,36 100,0
Stack: Top Layer 0.035mm / Dielectric1 1.51mm FR4 er 4.5 / Bottom Layer 0.035mm

## Design rules (mm)
template: JLCPCB Capability(Two Layers Board)
spacing copperThickness1oz (default): track to track 0.102, other pairs 0.152 to 0.3
spacing copperThickness2oz: track to track 0.203, other pairs 0.152 to 0.3
track width copperThickness1oz (default): min 0.127, default 0.254, max 2.54
track width copperThickness2oz: min 0.203, default 0.254, max 2.54
differential pair differentialPair (default): width min 0.127, default 0.254, max 2.54; gap min 0.152, default 0.152
via viaSize (default): diameter min 0.5, default 0.61, max 10; hole min 0.3, default 0.305, max 6.3

## Placement (name value [footprint] x y rotation side)
C1  100nF  [C0201]  5.08 27.24 270 top
C2  10uF  [C0402]  6.22 26.73 90 top
C3  100nF  [C0201]  48.89 23.17 180 top
C4  100nF  [C0201]  56.13 13.65 180 top
C5  100nF  [C0201]  78.11 13.52 180 top
Cboot  100nF  [C0201]  20.7 17.12 180 top
Ccomp  2.7nF  [C0402]  24.51 13.01 180 top
Ccomp2  10pF  [C0402]  22.22 13.52 270 top
Cin  10uF  [C1206]  8.55 16.57 270 top
Cin2  10uF  [C1206]  11.65 16.56 270 top
Cout  47uF  [C0805]  18.68 26 0 top
Cout2  47uF  [C0805]  18.67 23.85 0 top
Css  8.2nF  [C0201]  14.48 9.46 90 top
D1  B360AF-13  [SMA_L4.4-W2.6-LS5.0-RD]  18.03 20.25 180 top
ESP32_A1  HB-PH3-25415PB2GOP  [HDR-TH_5P-P2.54-V-M]  64.01 29.4 0 top
ESP32A  ESP32  [HDR-TH_19P-P2.54-V-F]  26.42 29.4 180 top
ESP32B  2.54-1*19P母  [HDR-TH_19P-P2.54-V-F]  26.42 6.54 180 top
H1  JTAG  [HDR-TH_6P-P2.54-V-M-1]  14.48 32.44 0 top
LED  2.54-1*3  [HDR-TH_3P-P2.54-V-M-1]  97.54 17.97 270 top
Motor0  Motor 0  [HDR-TH_4P-P2.54-V-M]  84.71 8.7 180 top
Motor1  Motor 1  [HDR-TH_4P-P2.54-V-M]  62.74 8.7 180 top
NOREF  -  [Pad_e82557]  92.46 4.25 0 top
NOREF#2  -  [Pad_e82547]  97.15 8.06 0 top
R14  100kΩ  [R0201]  44.96 27.36 180 top
R15  10kΩ  [R0201]  43.31 27.36 180 top
R16  1kΩ  [R01005]  22.61 4.76 180 top
R17  68.1kΩ  [R0201]  7.87 11.36 90 top
R18  332kΩ  [R0201]  7.87 12.89 90 top
Rcomp  13.7kΩ  [R0201]  26.29 13.65 270 top
Rfbb  1.96kΩ  [R0201]  22.1 10.6 90 top
Rfbt  10.2kΩ  [R0201]  24.13 11.78 0 top
TMC0A  TMC0A  [HDR-TH_8P-P2.54-V-F-1]  84.71 24.3 180 top
TMC0B  2.54-1*8P母环保  [HDR-TH_8P-P2.54-V-F-1]  84.71 11.6 180 top
TMC1A  TMC2209  [HDR-TH_8P-P2.54-V-F-1]  62.7 24.3 180 top
TMC1B  2.54-1*8P母环保  [HDR-TH_8P-P2.54-V-F-1]  62.7 11.6 180 top
U4  TPS54331DR  [SOIC-8_L5.0-W4.0-P1.27-LS6.0-BL]  17.15 13.69 270 top
U13  15uH  [IND-SMD_L7.2-W6.6_GPSR07X0]  24.89 22.67 90 top
U14  HB-PH3-25417PB2GOP  [HDR-TH_7P-P2.54-V-M]  61.37 5.39 0 top

## Footprints (pads in the part's own frame, mm; a bottom-side part is the same pattern mirrored in y, then rotated)
C0201
  rect 0.368x0.324 smd: 1(-0.275,0) 2(0.275,0)
C0402
  rect 0.79x0.54 smd: 1(-0.545,0) 2(0.545,0)
C0805
  rect 1.41x1.35 smd: 1(-1,0) 2(1,0)
C1206
  rect 1.485x1.728 smd: 1(-1.593,0) 2(1.593,0)
HDR-TH_3P-P2.54-V-M-1
  rect 1.575x1.8 hole 1.2: 1(-2.54,0)
  round 1.8 hole 1.2: 2(0,0) 3(2.54,0)
HDR-TH_4P-P2.54-V-M
  rect 1.7x1.7 hole 1.1: 1(-3.81,0)
  round 1.7 hole 1.1: 2(-1.27,0) 3(1.27,0) 4(3.81,0)
HDR-TH_5P-P2.54-V-M
  rect 1.7x1.7 hole 1.1: 1(-5.08,0)
  round 1.7 hole 1.1: 2(-2.54,0) 3(0,0) 4(2.54,0) 5(5.08,0)
HDR-TH_6P-P2.54-V-M-1
  rect 1.8x1.8 hole 1.2: 1(-6.35,0)
  round 1.8 hole 1.2: 2(-3.81,0) 3(-1.27,0) 4(1.27,0) 5(3.81,0) 6(6.35,0)
HDR-TH_7P-P2.54-V-M
  rect 1.7x1.7 hole 1.1: 1(-7.62,0)
  round 1.7 hole 1.1: 2(-5.08,0) 3(-2.54,0) 4(0,0) 5(2.54,0) 6(5.08,0) 7(7.62,0)
HDR-TH_8P-P2.54-V-F-1
  rect 1.8x1.8 hole 1.2: 1(-8.89,0)
  round 1.8 hole 1.2: 2(-6.35,0) 3(-3.81,0) 4(-1.27,0) 5(1.27,0) 6(3.81,0) 7(6.35,0) 8(8.89,0)
HDR-TH_19P-P2.54-V-F
  rect 1.6x1.6 hole 1.05: 1(-22.86,0)
  round 1.6 hole 1.05: 2(-20.32,0) 3(-17.78,0) 4(-15.24,0) 5(-12.7,0) 6(-10.16,0) 7(-7.62,0) 8(-5.08,0) 9(-2.54,0) 10(0,0) 11(2.54,0) 12(5.08,0) 13(7.62,0) 14(10.16,0) 15(12.7,0) 16(15.24,0) 17(17.78,0) 18(20.32,0) 19(22.86,0)
IND-SMD_L7.2-W6.6_GPSR07X0
  rect 2.35x3.5 smd: 1(-2.85,0) 2(2.85,0)
Pad_e82547
  round 4 hole 2.5: BATT(0,0)
Pad_e82557
  round 4 hole 2.5: BATT(0,0)
R0201
  rect 0.303x0.324 smd: 1(-0.241,0) 2(0.241,0)
R01005
  rect 0.18x0.216 smd: 1(-0.17,0) 2(0.17,0)
SMA_L4.4-W2.6-LS5.0-RD
  rect 1.8x1.7 smd: 1(-2.192,0) 2(2.192,0)
SOIC-8_L5.0-W4.0-P1.27-LS6.0-BL
  oval 0.569x1.95 smd: 1(-1.905,-2.705) 2(-0.635,-2.705) 3(0.635,-2.705) 4(1.905,-2.705) 5(1.905,2.705) 6(0.635,2.705) 7(-0.635,2.705) 8(-1.905,2.705)

## Nets
As in the schematic, except:
GND: C1.2 C2.1 C3.2 C4.2 C5.2 Ccomp2.1 Cin.1 Cin2.1 Cout.1 Cout2.1 Css.1 D1.2 ESP32_A1.4 ESP32B.1 ESP32B.7 LED.3 NOREF.BATT R15.2 R17.1 Rcomp.1 Rfbb.1 TMC0B.2 TMC0B.8 TMC1B.2 TMC1B.8 U4.7 U14.6
VIN: Cin.2 Cin2.2 NOREF#2.BATT R14.1 R18.2 TMC0B.1 TMC1B.1 U4.2
$1N13569: ESP32B.6 U14.4
$1N13578: ESP32B.3 U14.1

Pads without a net: ESP32A 1 2 16 17 18; ESP32B 17 18 19; TMC0A 5 6; TMC1A 5 6

## Via types
v1: diameter 0.61, hole 0.304, Top Layer to Bottom Layer, 13 vias
v2: diameter 1.5, hole 0.9, Top Layer to Bottom Layer, 4 vias
v3: diameter 4, hole 3, Top Layer to Bottom Layer, 4 vias
v4: diameter 0.61, hole 0.305, Top Layer to Bottom Layer, 5 vias
v5: diameter 1.8, hole 1.2, Top Layer to Bottom Layer, 8 vias

## Routing (per net, layer and track width the routed paths; a pad name or vN(x,y) marks a point on that pad's centre or on a via; arc(x,y) is an arc through that point)
GND:
  vias: v1(9.53,25.88) v1(9.53,23.34) v1(9.53,20.8) v1(12.07,25.88) v1(12.07,23.34) v1(12.07,20.8) v1(14.61,25.88) v1(14.61,23.34) v1(17.15,20.8) v1(17.15,18.26) v1(17.15,15.72) v1(17.15,13.18) v1(17.15,10.64) v2(71.59,18.58) v2(93.6,18.6) v3(2.54,2.6) v3(2.79,33.21) v3(97.15,33.08) v3(97.15,2.98) v4(10.41,13.01) v5(46.65,25.08)
VCC: length 225.4
  Top Layer w0.254: U14.7 72.15,5.39 TMC0B.7 78.36,13.5 C5.1 78.38,14.16 78.13,14.41 56.26,14.41 ; 25.47,25.52 26.9,25.52 27.73,26.35 47.92,26.35 v5(49.19,25.08) 49.19,21.48 56.26,14.41 ; 25.47,25.52 27.69,23.29 27.69,13.27 26.2,11.78 Rfbt.2 ; 25.47,25.52 U13.2 ; 56.26,14.41 56.41,14.26 C4.1 56.35,13.59 TMC1B.7
  Top Layer w0.75: 19.68,26.13 19.68,26.48 18.41,27.75 5.21,27.75 ESP32A.19 6.6,32.44 H1.1
  Bottom Layer w0.254: ESP32_A1.5 69.09,34.85 69.1,34.86
  Bottom Layer w0.75: LED.1 97.54,26.6 89.28,34.86 8.76,34.86 8.13,34.22 H1.1
VIN: length 163.8
  Top Layer w0.254: R14.1 48.64,27.36 59.94,16.06 71.57,16.06 v2(71.59,16.08) ; R18.2 7.87,14.31 Cin.2 ; 14.44,14.32 13.08,14.32
  Top Layer w0.75: 7.88,14.89 7.85,14.89 1.4,8.44 1.4,6.16 2.43,5.13 3.59,5.13 7.24,1.47 v4(7.24,1.46)
  Bottom Layer w0.75: v4(7.24,1.46) 7.25,1.45 ; 71.63,11.46 71.63,2.42 70.53,1.32 7.25,1.32
  Bottom Layer w2: NOREF#2.BATT 97.14,8.06 TMC0B.1 v2(93.6,16.08) v2(71.59,16.08) ; 71.63,16.07 71.63,11.46
$1N1921:
  vias: v5(33.95,25.08)
$1N1932:
  vias: v5(36.49,25.08)
$1N1947:
  vias: v5(39.03,25.08)
$1N2154: length 2.9
  Top Layer w2: TMC1B.3 66.51,8.73 Motor1.1
$1N2157: length 2.9
  Top Layer w2: Motor1.2 64.01,11.56 TMC1B.4
$1N2160: length 2.9
  Top Layer w2: Motor1.3 61.47,11.56 TMC1B.5
$1N2163: length 2.9
  Top Layer w2: TMC1B.6 58.89,8.73 Motor1.4
$1N2166: length 2.9
  Top Layer w2: TMC0B.3 Motor0.1
$1N2169: length 2.9
  Top Layer w2: TMC0B.4 Motor0.2
$1N2172: length 2.9
  Top Layer w2: 83.44,11.6 83.44,8.7
$1N2175: length 2.9
  Top Layer w2: TMC0B.6 Motor0.4
$1N2313: length 31.1
  Top Layer w0.254: TMC1A.7 56.35,27.53 51.82,32.06 34.16,32.06 ESP32A.8
$1N2318: length 56.3
  Top Layer w0.254: 75.82,24.3 75.82,31.43 74.04,33.21 32.77,33.21 ESP32A.9
$1N2522: length 2.2
  Top Layer w0.254: 22.8,4.79 23.88,5.86 ESP32B.11
$1N11068: length 4.3
  Top Layer w0.254: H1.4 ESP32A.13
$1N11073: length 4.3
  Top Layer w0.254: H1.3 ESP32A.14
$1N11078: length 4.3
  Top Layer w0.254: H1.2 ESP32A.15
$1N13375: length 37.5
  Top Layer w0.254: ESP32B.2 45.08,4.89 30.86,4.89 30.23,5.52 30.23,23.89 v5(31.41,25.08)
$1N13569: length 48.4
  Top Layer w0.254: v5(41.57,25.08) 39.88,23.39 39.88,9.84 ESP32B.6
  Bottom Layer w0.254: 61.47,5.39 59.82,7.04 57.4,7.04 54.99,9.46 39.5,9.46 ESP32B.6
$1N13578: length 29.2
  Top Layer w0.254: ESP32B.3 44.2,25.04 44.15,25.04 v5(44.11,25.08)
  Bottom Layer w0.254: 53.85,5.39 53.72,5.39 53.21,4.89 45.85,4.89 ESP32B.3
$1N15484: length 4.4
  Top Layer w0.254: ESP32A.12 H1.5 18.29,32.57
$1N15612: length 31.8
  Bottom Layer w0.254: ESP32B.16 12.83,8.19 16.13,8.19 20.07,12.12 20.07,30.41 20.83,31.17 H1.6
$1N19994: length 96.9
  Top Layer w0.254: ESP32B.15 13.72,4.38 16.64,1.46 85.85,1.46 95.89,11.49 95.89,16.31 LED.2
$1N28037: length 3.3
  Top Layer w0.254: 44.2,27.36 R14.2 ; 44.2,27.36 44.2,27.42 ; 44.2,27.36 44.14,27.36 ; 44.2,27.42 ESP32A.3 ; 44.2,27.42 44.14,27.36 ; 44.14,27.36 R15.1
$1N28083: length 62
  Top Layer w0.254: ESP32A.10 31.37,34.35 74.93,34.35 78.36,30.92 TMC0A.7
$1N28088: length 25.4
  Top Layer w0.254: TMC1A.8 53.81,28.04 50.8,31.05 35.69,31.05 ESP32A.7
$1N28304: length 99.9
  Top Layer w0.254: 73.1,22.92 92.22,22.92 TMC0A.1 82.4,35.49 29.97,35.49 ESP32A.11 ; 72.97,22.92 TMC1A.1
$1N28357: length 68.1
  Bottom Layer w0.254: ESP32B.8 38.73,13.78 65.15,13.78 68.93,17.55 86.33,17.55 91.06,22.28 TMC0A.2
$1N28418: length 68.4
  Bottom Layer w0.254: TMC0A.3 88.52,23.05 85.47,20 68.58,20 65.02,16.44 37.59,16.44 28.96,7.81 ESP32B.9
$1N28428: length 106.8
  Top Layer w0.254: 22.41,4.79 21.34,5.86 ESP32B.12 ; 22.41,4.73 22.35,4.67 22.35,3.74 22.86,3.23 78.11,3.23 79.54,4.67 79.54,12.54 84.84,17.84 v4(84.84,21.95)
  Bottom Layer w0.254: TMC1A.4 65.51,25.84 84.44,25.84 TMC0A.4 85.98,23.05 84.89,21.95 v4(84.84,21.95)
$1N28444: length 52.1
  Bottom Layer w0.254: TMC1A.2 69.05,23.52 64.77,19.24 36.32,19.24 26.42,9.33 ESP32B.10
$1N28452: length 55.1
  Bottom Layer w0.254: ESP32B.13 18.93,6.54 34.17,21.78 63.99,21.78 TMC1A.3
$1N31798: length 18.8
  Bottom Layer w0.254: 58.93,29.27 57.02,31.17 43.43,31.17 ESP32A.4
$1N31802: length 25
  Bottom Layer w0.254: ESP32A.5 39.12,29.78 41.53,32.19 58.67,32.19 ESP32_A1.2 61.47,29.27
$1N31807: length 30.7
  Bottom Layer w0.254: ESP32_A1.3 60.07,33.33 40.51,33.33 ESP32A.6
$1N31812: length 50.4
  Bottom Layer w0.254: 64.01,5.27 63.88,5.27 61.21,2.6 20.07,2.6 16.26,6.41
$1N31817: length 21.7
  Bottom Layer w0.254: ESP32B.5 41.91,3.74 57.15,3.74 58.8,5.39 58.93,5.39
$1N31823: length 16.7
  Bottom Layer w0.254: ESP32B.4 43.43,8.31 53.34,8.31 56.26,5.39 56.39,5.39
$2N758: length 2.1
  Top Layer w0.254: 14.44,9.77 14.44,11.78 ; 14.44,11.78 14.44,11.78 ; 14.44,11.78 14.44,11.91
$2N763: length 7.5
  Top Layer w0.254: Cboot.2 v4(19.15,17.12) ; 14.44,15.59 14.44,17.08 v4(14.48,17.12)
  Bottom Layer w0.254: 19.15,17.25 19.03,17.12 v4(14.48,17.12)
$2N769: length 7.9
  Top Layer w0.254: 14.44,13.05 13.12,13.05 12.19,12.12 7.9,12.12 7.87,12.16 ; 7.87,12.52 7.87,12.16 ; 7.87,12.16 R17.2
$2N774: length 4.2
  Top Layer w0.254: Ccomp.2 23.93,12.98 Ccomp2.2 22.15,13.05 U4.6
$2N777: length 5
  Top Layer w0.254: 22.07,11.78 Rfbt.1 ; 22.07,11.78 U4.5 ; 22.07,11.78 22.1,11.76 Rfbb.2
$2N4046: length 1.4
  Top Layer w0.254: Ccomp.1 25.9,13.01 Rcomp.2

## Copper pours and planes (outline as drawn; the poured copper is in the pictures)
GND on Top Layer: -0.38,36.76 100.84,36.76 100.84,-0.7 -0.38,-0.7
GND on Top Layer: 18.16,14.83 27.3,14.83 27.3,13.82 18.16,13.82
GND on Top Layer: 6.99,9.24 6.99,8.1 25.78,8.1 25.78,10.39 18.42,10.39 18.42,27.15 6.99,27.15 6.99,16.48 13.46,16.48 13.46,18.13 15.88,18.13 15.88,9.24
GND on Bottom Layer: -1.02,36.64 100.71,36.64 100.71,-0.45 -1.02,-0.45
VCC on Top Layer: 18.92,27.15 18.92,22.71 27.31,22.71 27.31,27.15
VIN on Top Layer: 6.96,14.96 15.62,14.96 15.62,13.69 6.96,13.69
PH on Top Layer: 18.65,16.08 18.65,15.21 27.31,15.21 27.31,22.2 18.92,22.2 18.92,18.26 20.7,18.26 20.7,16.08

## Text on the board
Top Silkscreen Layer: - | MPU6050 | SCL | GPIO1 | GPIO3 | GPIO39 | SDA | GPIO34 | GPIO0 | GPIO35 | GND | +5V | + | D | U1 | U0
